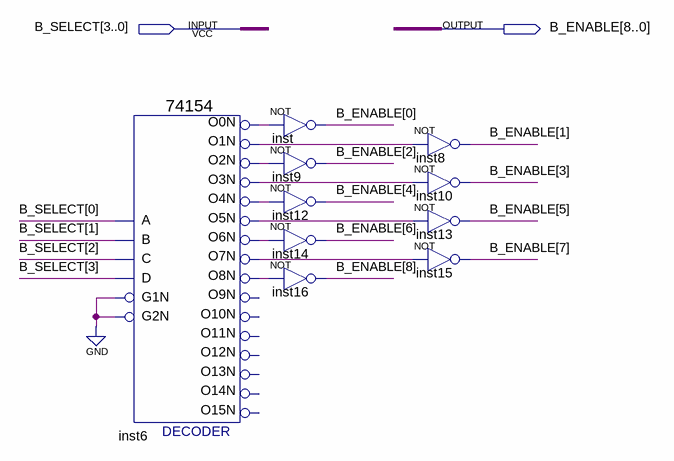
[diagram p0: schematic sheet]
// Quartus schematic decoder4to16.bdf as structural Verilog: 10 symbols, 2 pins
module decoder4to16 (
  input  [3:0] B_SELECT,
  output [8:0] B_ENABLE
);

  wire inst6_o0n, inst6_o1n, inst6_o2n, inst6_o3n, inst6_o4n, inst6_o5n, inst6_o6n, inst6_o7n, inst6_o8n;

  \74154  inst6 (
    .C(B_SELECT[2]), .D(B_SELECT[3]), .B(B_SELECT[1]), .A(B_SELECT[0]), .G1N(1'b0), .G2N(1'b0),
    .O0N(inst6_o0n), .O1N(inst6_o1n), .O4N(inst6_o4n), .O3N(inst6_o3n), .O2N(inst6_o2n), .O7N(inst6_o7n),
    .O6N(inst6_o6n), .O5N(inst6_o5n), .O8N(inst6_o8n));  // open: O12N, O15N, O10N, O11N, O13N, O14N, O9N
  not inst (B_ENABLE[0], inst6_o0n);
  not inst9 (B_ENABLE[2], inst6_o2n);
  not inst12 (B_ENABLE[4], inst6_o4n);
  not inst14 (B_ENABLE[6], inst6_o6n);
  not inst16 (B_ENABLE[8], inst6_o8n);
  not inst8 (B_ENABLE[1], inst6_o1n);
  not inst10 (B_ENABLE[3], inst6_o3n);
  not inst13 (B_ENABLE[5], inst6_o5n);
  not inst15 (B_ENABLE[7], inst6_o7n);
endmodule
